# EasyEDA schematic 1-Schematic_VGA Disconnector.json
TITLE: VGA Disconnector; REV: 1.0; Date: 2020-02-22; Sheet: 1/1; Drawn By: L0op; Company: L0op
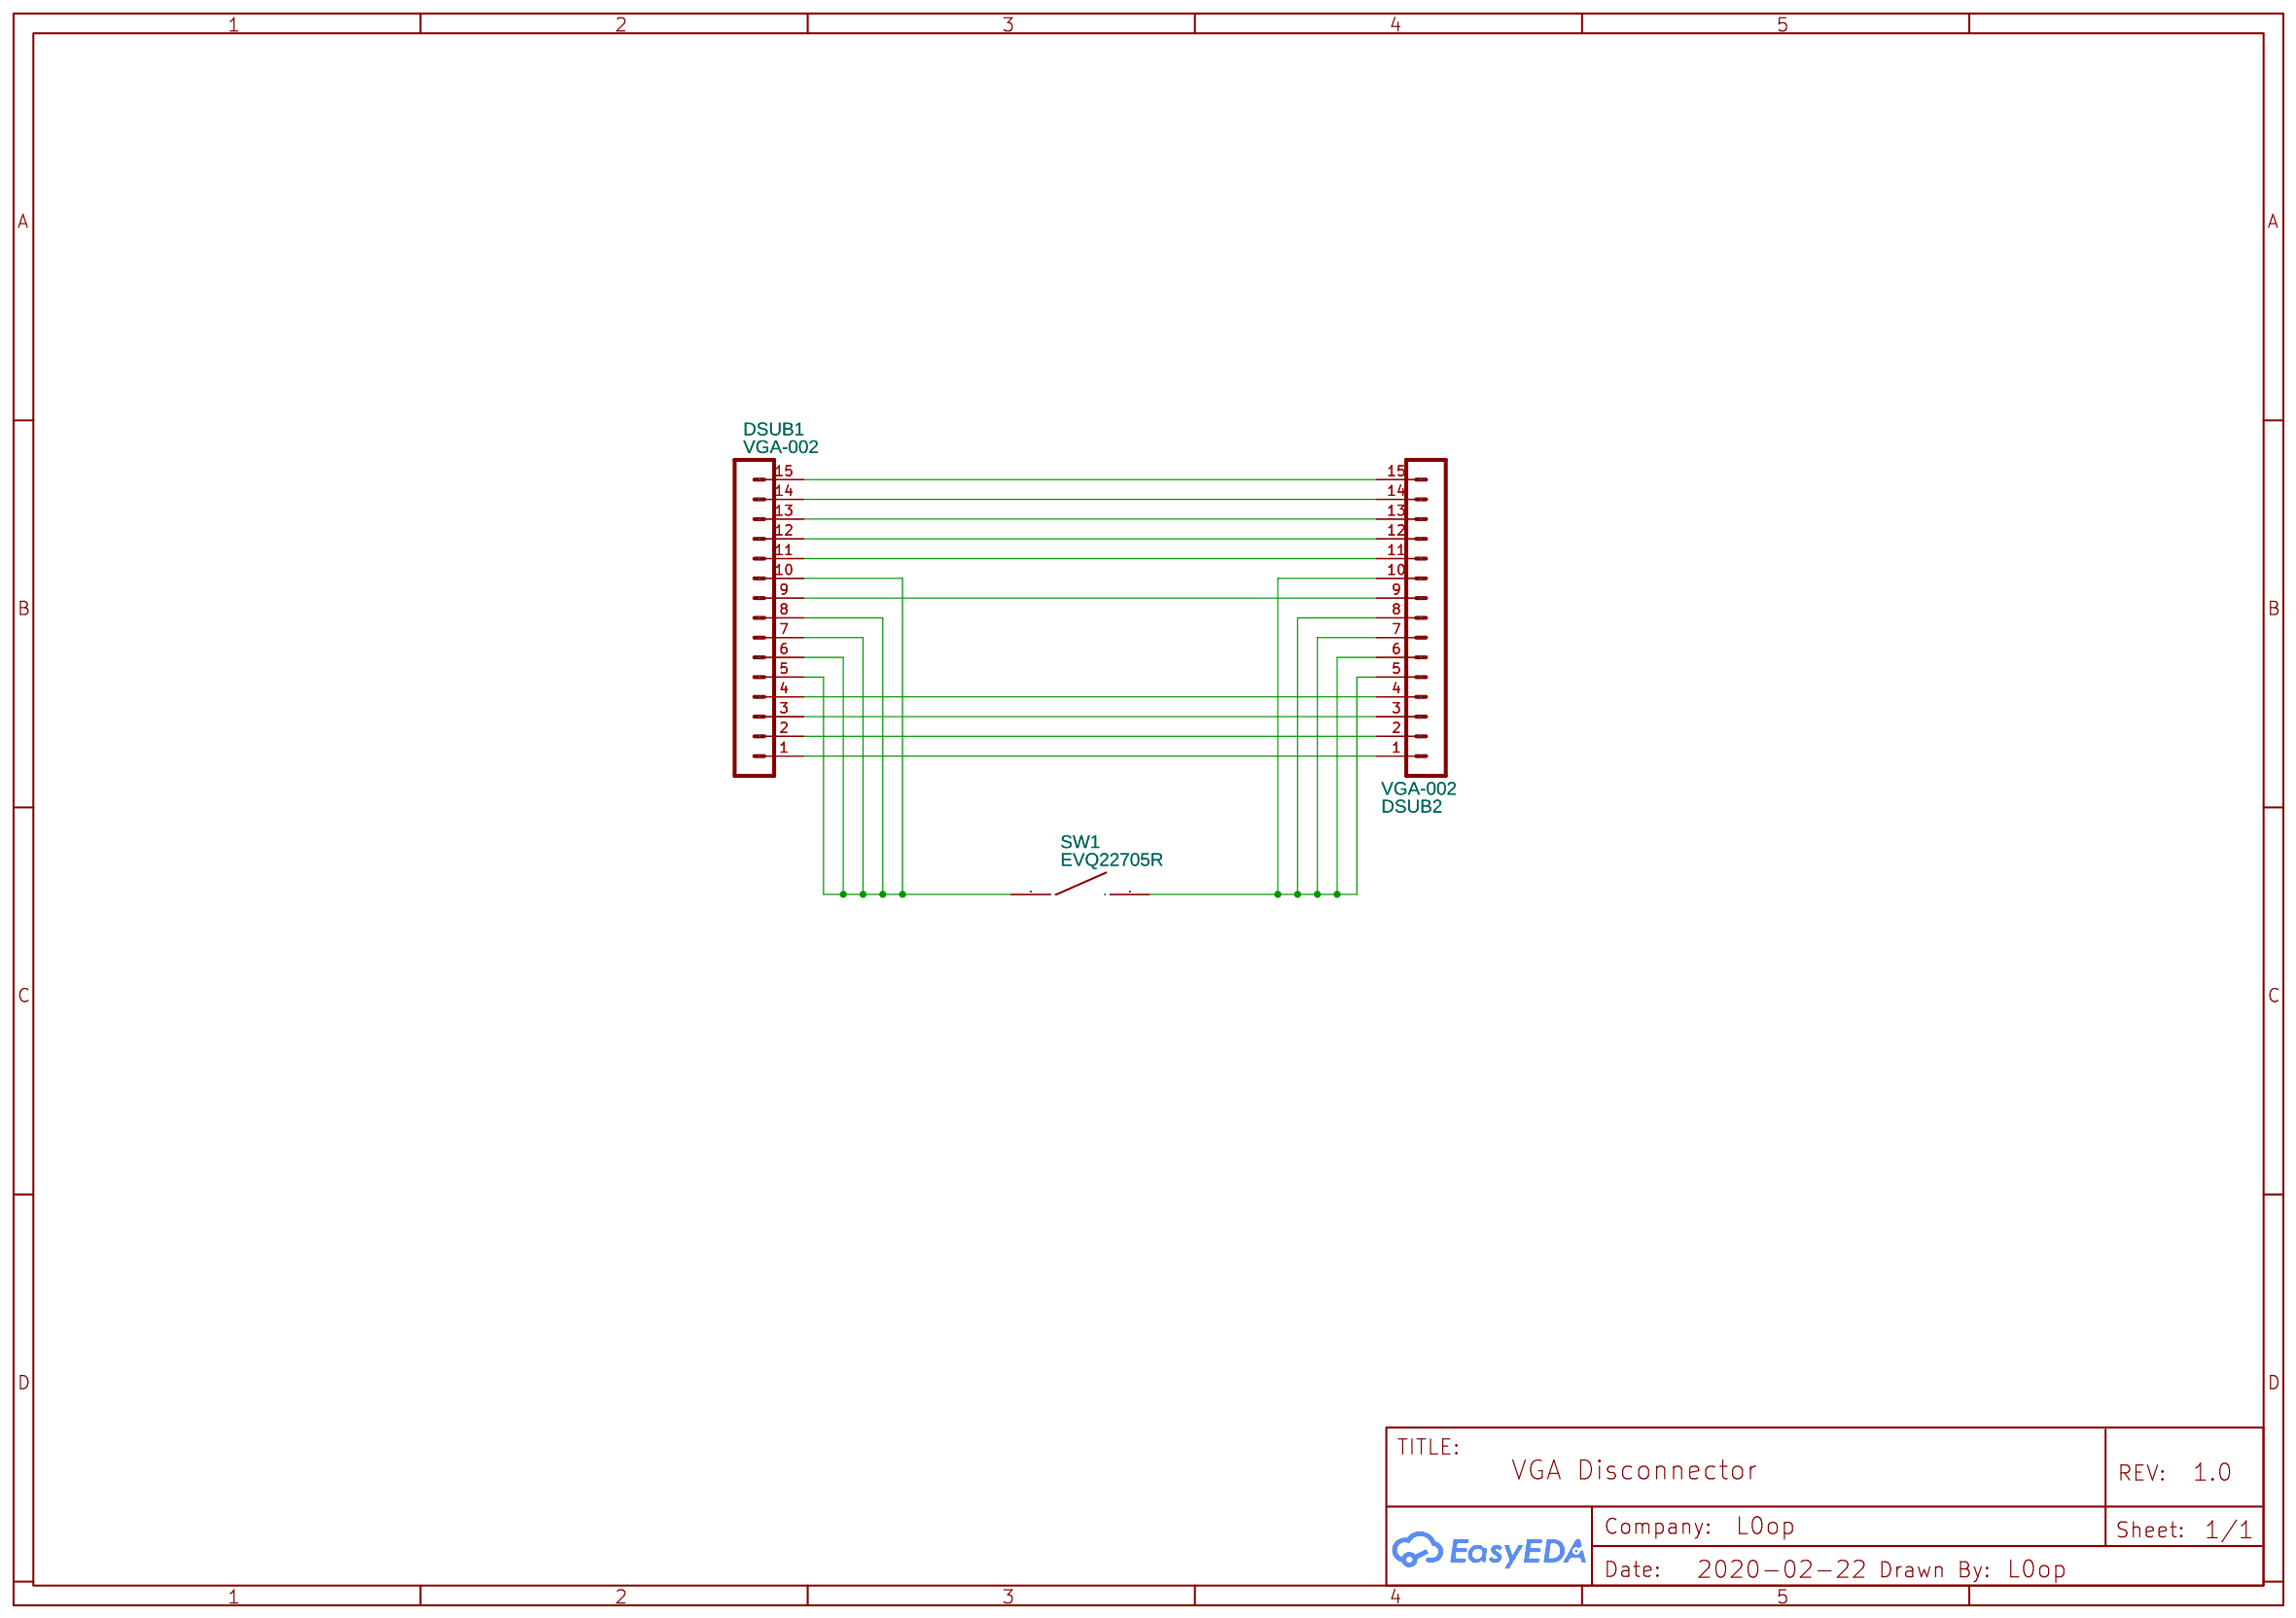
[diagram p0: schematic sheet]

## Parts
DSUB1  VGA-002  [D-SUB-TH_VGA-002]
DSUB2  VGA-002  [D-SUB-TH_VGA-002]
SW1  EVQ22705R  [KEY-6.0*6.0-4]

## Library data of the parts
DSUB1 DSUB2 = VGA-002: Supplier: LCSC; Manufacturer: BOOMELE; Supplier Part: C138387
SW1 = EVQ22705R: Supplier: LCSC; Manufacturer: PANASONIC; Contributor: LCSC; Supplier Part: C79156

## Nets
Net-(DSUB1-1): DSUB1.1 DSUB2.1
Net-(DSUB1-2): DSUB1.2 DSUB2.2
Net-(DSUB1-3): DSUB1.3 DSUB2.3
Net-(DSUB1-4): DSUB1.4 DSUB2.4
Net-(DSUB1-5): DSUB1.5 DSUB1.6 DSUB1.7 DSUB1.8 DSUB1.10 SW1.1
Net-(DSUB1-9): DSUB1.9 DSUB2.9
Net-(DSUB1-11): DSUB1.11 DSUB2.11
Net-(DSUB1-12): DSUB1.12 DSUB2.12
Net-(DSUB1-13): DSUB1.13 DSUB2.13
Net-(DSUB1-14): DSUB1.14 DSUB2.14
Net-(DSUB1-15): DSUB1.15 DSUB2.15
Net-(DSUB2-5): DSUB2.5 DSUB2.6 DSUB2.7 DSUB2.8 DSUB2.10 SW1.2
